# EAGLE design board_0.6v (EAGLE 7.7.0)
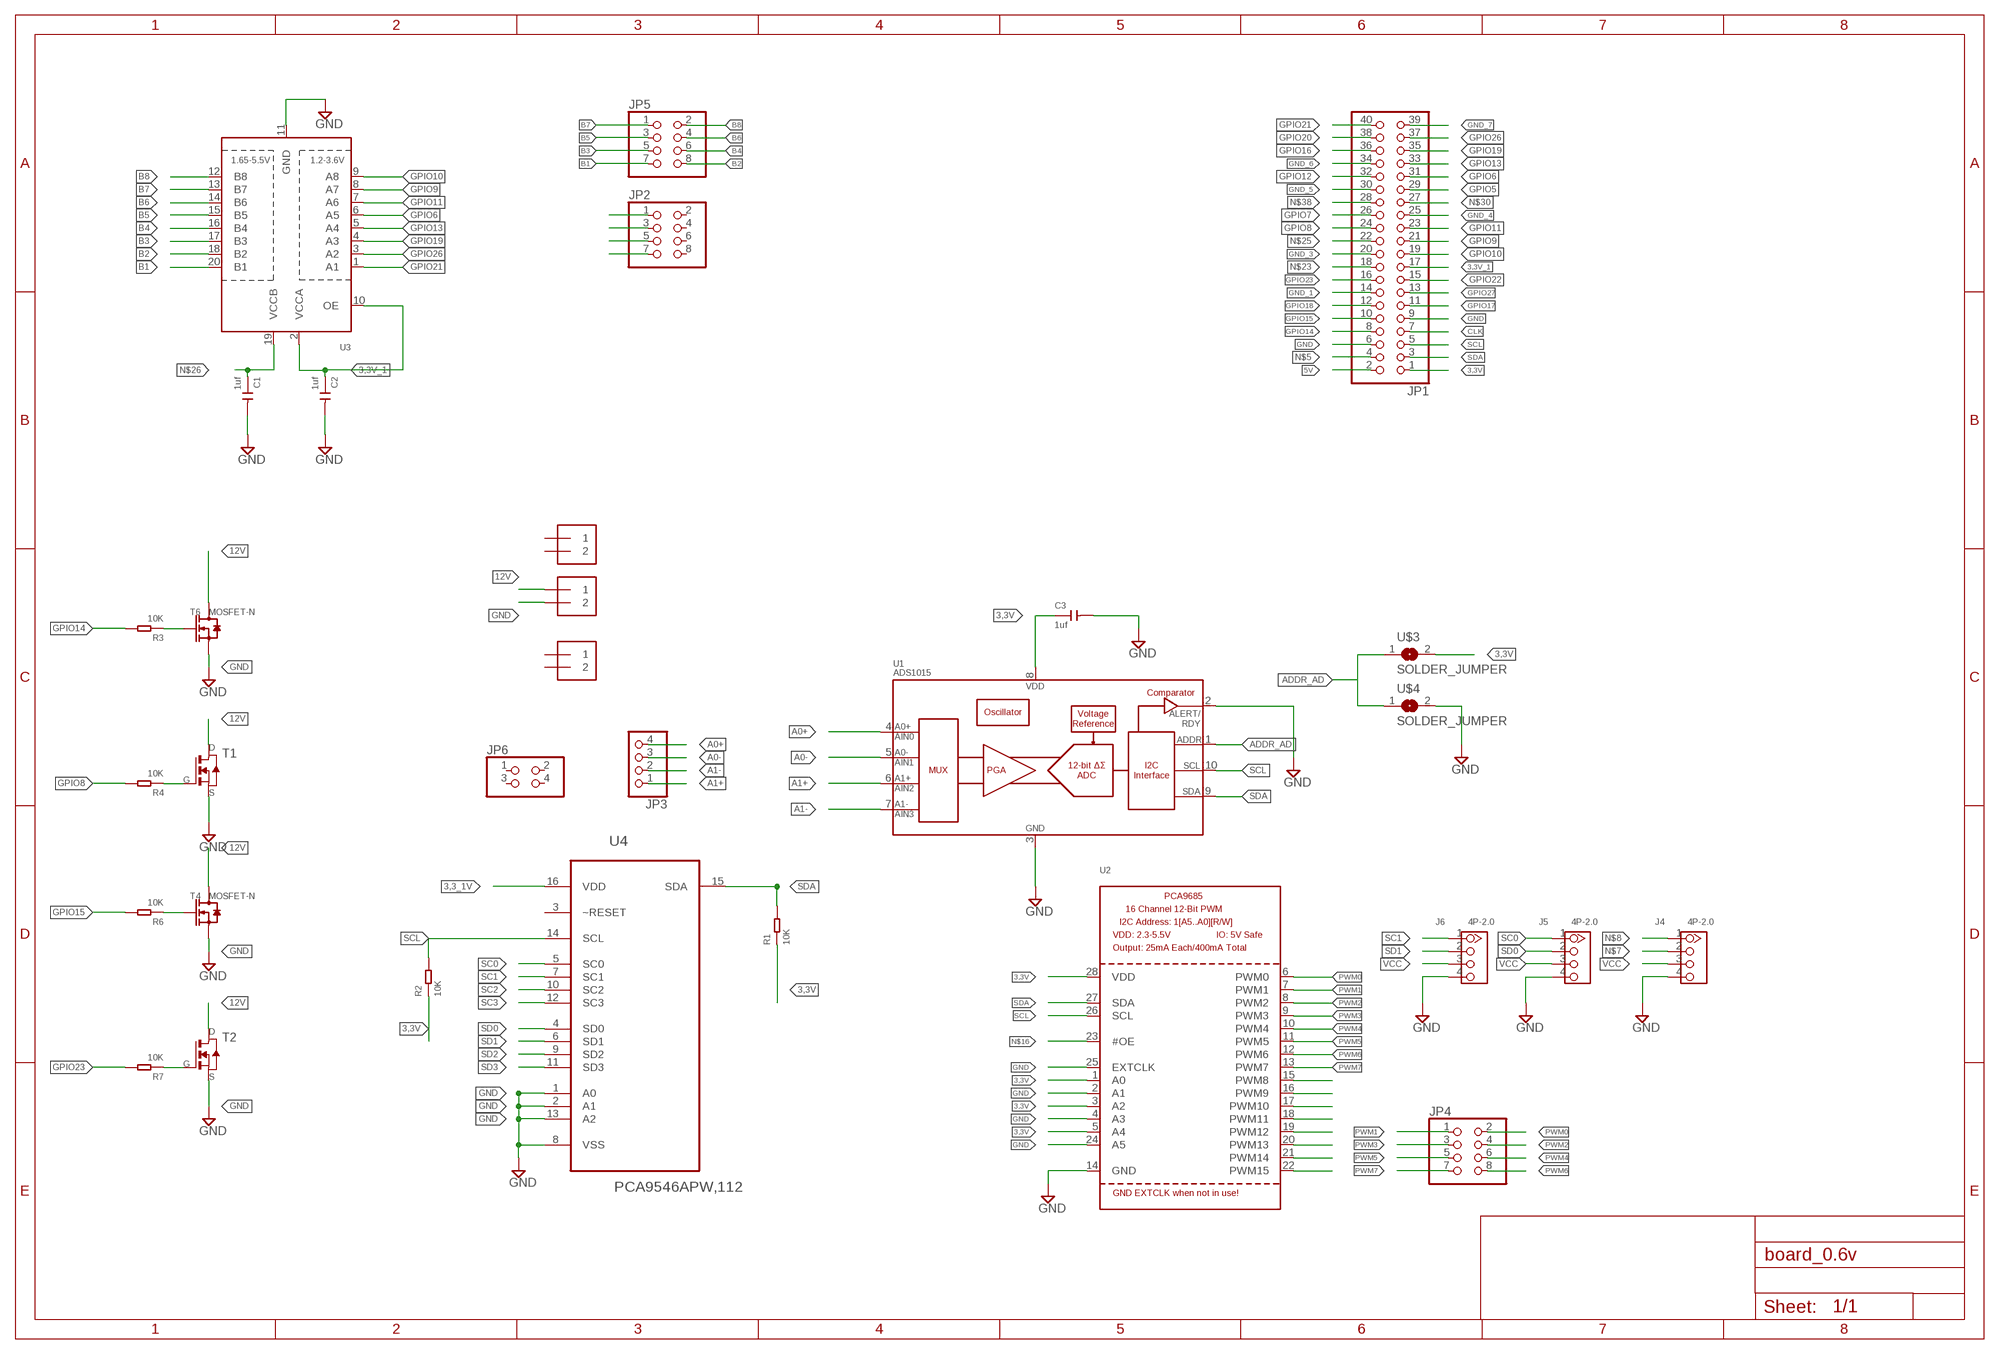
[diagram p0: schematic, sheet 1]

## Parts
C1  1uf  CERAMIC-1UF-25V-10%-X7R(0805)  [C0805]
C2  1uf  CERAMIC-1UF-25V-10%-X7R(0805)  [C0805]
C3  1uf  CERAMIC-1UF-25V-10%-X7R(0805)  [C0805]
J1  1X2-3.5MM  [1X2-3.5MM]
J2  1X2-3.5MM  [1X2-3.5MM]
J3  1X2-3.5MM  [1X2-3.5MM]
J4  4P-2.0  GROVE-CONNECTOR-DIP(4P-2.0)  [HW4-2.0]
J5  4P-2.0  GROVE-CONNECTOR-DIP(4P-2.0)  [HW4-2.0]
J6  4P-2.0  GROVE-CONNECTOR-DIP(4P-2.0)  [HW4-2.0]
JP1  PINHD-2X20  [2X20]
JP2  PINHD-2X4  [2X04]
JP3  PINHD-1X4  [1X04]
JP4  PINHD-2X4  [2X04]
JP5  PINHD-2X4  [2X04]
JP6  PINHD-2X2  [2X02]
R1  10K  SMD-RES-10K-1%-1/8W(0805)  [R0805]
R2  10K  SMD-RES-10K-1%-1/8W(0805)  [R0805]
R3  10K  SMD-RES-10K-1%-1/8W(0805)  [R0805]
R4  10K  SMD-RES-10K-1%-1/8W(0805)  [R0805]
R6  10K  SMD-RES-10K-1%-1/8W(0805)  [R0805]
R7  10K  SMD-RES-10K-1%-1/8W(0805)  [R0805]
T1  NMOSFETTO252  [TO252]
T2  NMOSFETTO252  [TO252]
T4  MOSFET-N  [SOT-23]
T6  MOSFET-N  [SOT-23]
U1  ADS1015  [MSOP10]
U2  PCA9685  [TSSOP28]
U3  TXB0108PWR  [TSSOP20]
U4  PCA9546APW,112  [SOP65P640X110-16N]
U$3  SOLDER_JUMPER  [SJFAB]
U$4  SOLDER_JUMPER  [SJFAB]

## Nets
3,3_1V: U4.16(VDD)
3,3V: C3.1 JP1.1 R1.1 R2.1 U1.8(VDD) U2.1(A0) U2.3(A2) U2.5(A4) U2.28(VDD) U$3.2
3,3V_1: C2.1 JP1.17 U3.2(VCCA) U3.10(OE)
5V: JP1.2
12V: J2.1 T1.3(D) T2.3(D) T4.3(D) T6.3(D)
A0+: JP3.4 U1.4(AIN0)
A0-: JP3.3 U1.5(AIN1)
A1+: JP3.1 U1.6(AIN2)
A1-: JP3.2 U1.7(AIN3)
ADDR_AD: U1.1(ADDR) U$3.1 U$4.1
B1: JP5.7 U3.20(B1)
B2: JP5.8 U3.18(B2)
B3: JP5.5 U3.17(B3)
B4: JP5.6 U3.16(B4)
B5: JP5.3 U3.15(B5)
B6: JP5.4 U3.14(B6)
B7: JP5.1 U3.13(B7)
B8: JP5.2 U3.12(B8)
CLK: JP1.7
GND: C1.2 C2.2 C3.2 J2.2 J4.4 J5.4 J6.4 JP1.6 JP1.9 T1.2(S) T2.2(S) T4.2(S) T6.2(S) U1.2(ALERT/RDY) U1.3(VSS) U2.2(A1) U2.4(A3) U2.14(GND) U2.24(A5) U2.25(EXTCLK) U3.11(GND) U4.1(A0) U4.2(A1) U4.8(VSS) U4.13(A2) U$4.2
GND_1: JP1.14
GND_3: JP1.20
GND_4: JP1.25
GND_5: JP1.30
GND_6: JP1.34
GND_7: JP1.39
GPIO5: JP1.29
GPIO6: JP1.31 U3.6(A5)
GPIO7: JP1.26
GPIO8: JP1.24 R4.2
GPIO9: JP1.21 U3.8(A7)
GPIO10: JP1.19 U3.9(A8)
GPIO11: JP1.23 U3.7(A6)
GPIO12: JP1.32
GPIO13: JP1.33 U3.5(A4)
GPIO14: JP1.8 R3.2
GPIO15: JP1.10 R6.2
GPIO16: JP1.36
GPIO17: JP1.11
GPIO18: JP1.12
GPIO19: JP1.35 U3.4(A3)
GPIO20: JP1.38
GPIO21: JP1.40 U3.1(A1)
GPIO22: JP1.15
GPIO23: JP1.16 R7.2
GPIO26: JP1.37 U3.3(A2)
GPIO27: JP1.13
N$5: JP1.4
N$6: R3.1 T6.1(G)
N$7: J4.2
N$8: J4.1
N$9: R4.1 T1.1(G)
N$10: R6.1 T4.1(G)
N$11: R7.1 T2.1(G)
N$13: JP2.1
N$14: JP2.3
N$15: JP2.5
N$16: U2.23(#OE)
N$17: JP2.7
N$22: U2.15(PWM8)
N$23: JP1.18
N$24: U2.16(PWM9)
N$25: JP1.22
N$26: C1.1 U3.19(VCCB)
N$27: U2.17(PWM10)
N$28: U2.18(PWM11)
N$29: U2.19(PWM12)
N$30: JP1.27
N$31: U2.20(PWM13)
N$32: U2.21(PWM14)
N$33: U2.22(PWM15)
N$38: JP1.28
PWM0: JP4.2 U2.6(PWM0)
PWM1: JP4.1 U2.7(PWM1)
PWM2: JP4.4 U2.8(PWM2)
PWM3: JP4.3 U2.9(PWM3)
PWM4: JP4.6 U2.10(PWM4)
PWM5: JP4.5 U2.11(PWM5)
PWM6: JP4.8 U2.12(PWM6)
PWM7: JP4.7 U2.13(PWM7)
SC0: J5.1 U4.5(SC0)
SC1: J6.1 U4.7(SC1)
SC2: U4.10(SC2)
SC3: U4.12(SC3)
SCL: JP1.5 R2.2 U1.10(SCL) U2.26(SCL) U4.14(SCL)
SD0: J5.2 U4.4(SD0)
SD1: J6.2 U4.6(SD1)
SD2: U4.9(SD2)
SD3: U4.11(SD3)
SDA: JP1.3 R1.2 U1.9(SDA) U2.27(SDA) U4.15(SDA)
VCC: J4.3 J5.3 J6.3
Unconnected: J1.1 J1.2 J3.1 J3.2 JP2.2 JP2.4 JP2.6 JP2.8 JP6.1 JP6.2 JP6.3 JP6.4 U4.3(~RESET)

## Library data of the parts
C1-C3 = Seeed-OPL-Capacitor:CERAMIC-1UF-25V-10%-X7R(0805): 302010179; MPN: CC0805KKX7R8BB105
J1-J3 = adafruit:1X2: 3.5mm Terminal block http://www.ladyada.net/library/pcb/eaglelibrary.html
J4-J6 = Seeed-OPL-Connector:GROVE-CONNECTOR-DIP(4P-2.0): 320110033
JP1 = adafruit:PINHD-2X20: PIN HEADER
JP2 JP4 JP5 = adafruit:PINHD-2X4: PIN HEADER
JP3 = pinhead:PINHD-1X4: PIN HEADER
JP6 = pinhead:PINHD-2X2: PIN HEADER
R1-R4 R6 R7 = Seeed-OPL-Resistor:SMD-RES-10K-1%-1/8W(0805): 301010361; MPN: RC0805FR-0710KL
T1 T2 = fab_2:NMOSFET: MOS FET
T4 T6 = Seeed-OPL-Transistor:MOSFET-N
U1 = SparkFun-IC-Conversion:ADS1015: ADS1015 12-BIT ADC 12-Bit Del-Sig ADC Four single-ended inputs or two differential inputs Internal PGA I2C interface 2.0-5.5V SparkFun Products SparkFun Block for Intel Edison - ADC <https://www.sparkfun.com/products/13770> (DEV-13770); PROD_ID: IC-12270
U2 = adafruit:PCA9685: PCA9685 - 16 Channel 12-Bit I2C PWM Controller 5.0V tolerant 16 channel, 12-bit I2C PWM controller with 25mA per output (max. 400mA total) Digikey: 568-5931-1-ND
U3 = adafruit:TXB0108PWR: 8-Bit Bi-Directional Level Shifter 1.2V-3.6V (VCCA) to 1.65V-5.5V (VCCB) bi-directional level shifter with auto direction sensing. Max data rate - VCCA 1.8V: 20Mbps (50ns), VCCA 3.3V: 100Mbps (10ns) Digikey: 296-21527-1-ND
U4 = NXP_By_element14_Batch_1:PCA9546APW,112: 4-channel I2C-bus switch with reset; MPN: PCA9546APW,112; OC_FARNELL: 1831208; OC_NEWARK: 70R6610; PACKAGE: TSSOP-16; SUPPLIER: NXP
U$3 U$4 = fab:SOLDER_JUMPER

## Board
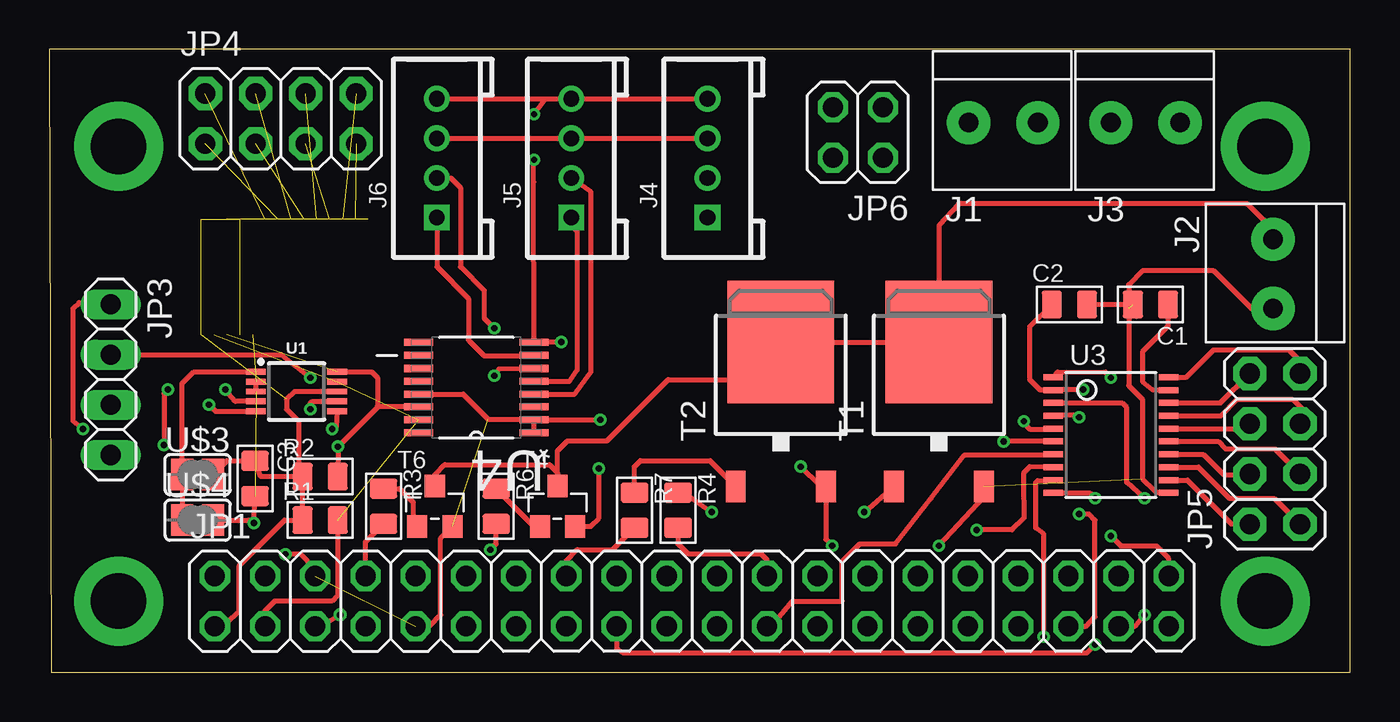
[diagram p1: board, top side]
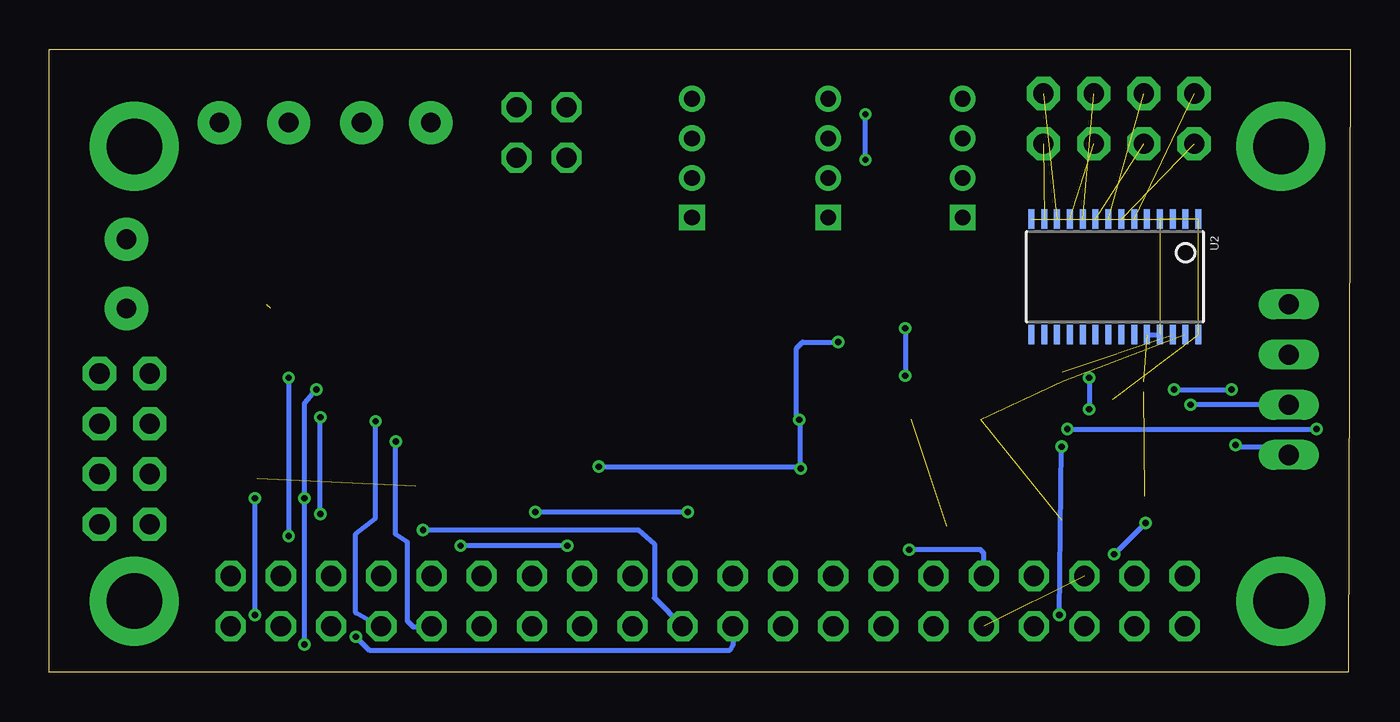
[diagram p2: board, bottom side, seen from below]

Size 65.8 x 31.5 mm. Coordinates in mm from the lower left corner, seen from the top.
Outline: 0.1,0 65.8,0 65.8,31.5 0,31.5 0.1,0
Copper layers (1*16): Top 0.035mm / dielectric 1.5mm / Bottom 0.035mm
Design rules "SeeedStudio_2layer_DRU_no_angle_20140221": minimum track width 6mil, minimum drill 12mil, track to track 6mil, track to pad 6mil, pad to pad 6mil, via to via 6mil, smd to smd 0mil, copper to edge 10mil, drill to drill 10mil, minimum pad ring 10mil, minimum via ring 6mil, stop-mask expansion 2mil, vias tented up to drill 100mil, thermal gap 10mil

### Footprints (pad centres in the part's own frame; a part is rotated, then mirrored left to right if it is on the bottom)
C0805 = smd 1.397 x 1.016: 1 0,0.889; 2 0,-0.889
1X2-3.5MM = drill 1 pad 2.184: 1 1.8,0; 2 -1.7,0
HW4-2.0 = drill 0.8 pad 1.27 square: 1 -3,0 | drill 0.8 pad 1.27: 2 -1,0; 3 1,0; 4 3,0
2X20 = drill 1.016 octagon: 1 -24.13,-1.27; 2 -24.13,1.27; 3 -21.59,-1.27; 4 -21.59,1.27; 5 -19.05,-1.27; 6 -19.05,1.27; 7 -16.51,-1.27; 8 -16.51,1.27; 9 -13.97,-1.27; 10 -13.97,1.27; 11 -11.43,-1.27; 12 -11.43,1.27; 13 -8.89,-1.27; 14 -8.89,1.27; 15 -6.35,-1.27; 16 -6.35,1.27; 17 -3.81,-1.27; 18 -3.81,1.27; 19 -1.27,-1.27; 20 -1.27,1.27; 21 1.27,-1.27; 22 1.27,1.27; 23 3.81,-1.27; 24 3.81,1.27; 25 6.35,-1.27; 26 6.35,1.27; 27 8.89,-1.27; 28 8.89,1.27; 29 11.43,-1.27; 30 11.43,1.27; 31 13.97,-1.27; 32 13.97,1.27; 33 16.51,-1.27; 34 16.51,1.27; 35 19.05,-1.27; 36 19.05,1.27; 37 21.59,-1.27; 38 21.59,1.27; 39 24.13,-1.27; 40 24.13,1.27
2X04 = drill 1.016 pad 1.676 octagon: 1 -3.81,-1.27; 2 -3.81,1.27; 3 -1.27,-1.27; 4 -1.27,1.27; 5 1.27,-1.27; 6 1.27,1.27; 7 3.81,-1.27; 8 3.81,1.27
1X04 = drill 1.016 long: 1 -3.81,0; 2 -1.27,0; 3 1.27,0; 4 3.81,0
2X02 = drill 1.016 octagon: 1 -1.27,-1.27; 2 -1.27,1.27; 3 1.27,-1.27; 4 1.27,1.27
R0805 = smd 1.397 x 1.016: 1 0,0.889; 2 0,-0.889
TO252 = smd 1 x 1.6: 1 -2.28,-4.8; 2 2.28,-4.8 | smd 5.4 x 6.2: 3 0,2.5
SOT-23 = smd 1.016 x 1.143: 1 -0.889,-1.016; 2 0.889,-1.016; 3 0,1.016
MSOP10 = smd 0.3 x 1: 1 -1,-2.05; 2 -0.5,-2.05; 3 0,-2.05; 4 0.5,-2.05; 5 1,-2.05; 6 1,2.05; 7 0.5,2.05; 8 0,2.05; 9 -0.5,2.05; 10 -1,2.05
TSSOP28 = smd 0.305 x 0.991: 1 -4.225,-2.918; 2 -3.575,-2.918; 3 -2.925,-2.918; 4 -2.275,-2.918; 5 -1.625,-2.918; 6 -0.975,-2.918; 7 -0.325,-2.918; 8 0.325,-2.918; 9 0.975,-2.918; 10 1.625,-2.918; 11 2.275,-2.918; 12 2.925,-2.918; 13 3.575,-2.918; 14 4.225,-2.918; 15 4.225,2.918; 16 3.575,2.918; 17 2.925,2.918; 18 2.275,2.918; 19 1.625,2.918; 20 0.975,2.918; 21 0.325,2.918; 22 -0.325,2.918; 23 -0.975,2.918; 24 -1.625,2.918; 25 -2.275,2.918; 26 -2.925,2.918; 27 -3.575,2.918; 28 -4.225,2.918
TSSOP20 = smd 0.305 x 0.991: 1 -2.925,-2.918; 2 -2.275,-2.918; 3 -1.625,-2.918; 4 -0.975,-2.918; 5 -0.325,-2.918; 6 0.325,-2.918; 7 0.975,-2.918; 8 1.625,-2.918; 9 2.275,-2.918; 10 2.925,-2.918; 11 2.925,2.918; 12 2.275,2.918; 13 1.625,2.918; 14 0.975,2.918; 15 0.325,2.918; 16 -0.325,2.918; 17 -0.975,2.918; 18 -1.625,2.918; 19 -2.275,2.918; 20 -2.925,2.918
SOP65P640X110-16N = smd 1.473 x 0.356: 1 -2.921,2.286; 2 -2.921,1.626; 3 -2.921,0.965; 4 -2.921,0.33; 5 -2.921,-0.33; 6 -2.921,-0.965; 7 -2.921,-1.626; 8 -2.921,-2.286; 9 2.921,-2.286; 10 2.921,-1.626; 11 2.921,-0.965; 12 2.921,-0.33; 13 2.921,0.33; 14 2.921,0.965; 15 2.921,1.626; 16 2.921,2.286
SJFAB = smd 1.118 x 1.6: 1 -0.787,0; 2 0.787,0

### Placement (x,y rotation side)
C1  55.7,18.6 270 top
C2  51.6,18.6 90 top
C3  10.4,9.8 0 top
J1  48.3,27.8 180 top
J2  61.9,20.1 90 top
J3  55.5,27.8 180 top
J4  33.3,26 90 top
J5  26.4,26 90 top
J6  19.6,26 90 top
JP1  32.5,3.6 0 top
JP2  7.7,-15 0 top  (outside the outline)
JP3  3.1,14.8 270 top
JP4  11.7,28 0 top
JP5  62,11.3 90 top
JP6  40.9,27.3 180 top
R1  13.7,7.7 90 top
R2  13.7,9.9 90 top
R3  16.9,8.4 0 top
R4  31.8,8.2 0 top
R6  22.6,8.4 0 top
R7  29.6,8.2 0 top
T1  45,14.2 0 top
T2  37,14.2 0 top
T4  25.7,8.4 0 top
T6  19.5,8.4 0 top
U1  12.5,14.2 270 top
U2  11.9,20 180 bottom
U3  53.7,12 270 top
U4  21.6,14.4 180 top
U$3  7.5,10 0 top
U$4  7.5,7.7 0 top

### Tracks (layer width: path | path; a pad name or v marks a point on that pad's centre or on a via)
3,3V  (4 unrouted)
  Top 0.254: U$3.2 8.99,10.7 C3.1 10.69,9.9 R2.1 | R2.1 R1.1 11.9,7.7 10.6,6.4 9.81,5.6 9.6,5.4 9.6,3.1 8.73,2.33 JP1.1 | U1.8 12.4,14.2 12,13.8 12,13.3 12.6,12.7 12.6,9.91 R2.1
3,3V_1  (via drill 0.32)
  Top 0.254: JP1.17 28.69,1.21 29,1 52.5,1 v52.9,1.4 | v52.3,14.3 50.86,14.3 U3.2 50.12,14.27 49.6,14.8 49.6,17.49 C2.1 50.61,18.7 | U3.10 52.62,9.07 v52.9,8.8
  Bottom 0.254: v52.9,1.4 v52.9,8.8 52.9,13.6 v52.3,14.3
12V
  Top 0.254: J2.1 61.9,22.4 60.6,23.7 46,23.7 45,22.6 T1.3 T2.3 36.7,15.3 36.4,15.3 35.9,14.8 31.3,14.8 28.2,11.7 26.2,11.7 25.7,11.2 T4.3 25.7,10.1 25.3,10.5 20,10.5 19.5,10 T6.3
A0+  (via drill 0.32, 0.32 pad 0.25)
  Top 0.254: U1.4 9.4,13.7 v8.9,14.3 | v6,14.3 5.8,14.1 v5.8,11.5
  Bottom 0.254: v8.9,14.3 v6,14.3 | v5.8,11.5 5.6,11.4 3.51,11.4 JP3.4
A0-  (via drill 0.32)
  Top 0.254: v8.07,13.53 8.4,13.2 U1.5
  Bottom 0.254: JP3.3 v8.07,13.53
A1+  (via drill 0.32)
  Top 0.254: U1.6 14.5,12.4 14.4,12.3 v14.3,12.3 | v1.7,12.3 1.2,12.7 1.2,18.4 1.5,18.7 3.01,18.7 JP3.1
  Bottom 0.254: v14.3,12.3 v1.7,12.3
A1-  (via drill 0.32)
  Top 0.254: JP3.2 11.73,16.07 v13.2,14.9 | v13.2,13.3 13.2,13.6 13.3,13.7 U1.7
  Bottom 0.254: v13.2,14.9 v13.2,13.3
ADDR_AD
  Top 0.254: U1.1 7.3,15.2 6.71,14.61 U$3.1 U$4.1
B1
  Top 0.254: U3.20 57.52,14.93 58.9,16.3 62.7,16.3 63.3,15.7 63.3,15.14 JP5.7
B2
  Top 0.254: U3.18 59.24,13.62 JP5.8
B3
  Top 0.254: U3.17 59.27,12.97 60.1,13.8 62.9,13.8 63.4,13.3 63.4,12.7 JP5.5
B4
  Top 0.254: U3.16 60.48,12.32 JP5.6
B5
  Top 0.254: U3.15 59.12,11.67 59.5,11.3 62,11.3 JP5.3
B6
  Top 0.254: U3.14 58.38,11.02 59.4,10 60.7,10 JP5.4
B7
  Top 0.254: U3.13 58.12,10.38 59.7,8.8 61.96,8.8 JP5.1
B8
  Top 0.254: U3.12 57.58,9.72 59.81,7.49 JP5.2
GND  (via drill 0.32)  (9 unrouted)
  Top 0.254: U1.3 U1.2 | U4.1 U4.2 | J4.4 J5.4 25.1,29 | J6.4 25.1,29 | C1.2 C2.2 | J2.2 60.8,18.4 58.9,20.3 55.3,20.3 54.6,19.6 54.6,18.4 | 54.6,18.4 55,18 | U$4.2 10.09,7.7 v10.35,7.56 C3.2 | JP1.6 13.4,5.3 12.73,5.97 v11.93,5.97 | v24.52,28.22 25.1,29 | v24.52,25.92 24.5,25.9 24.5,24.8 U4.8 24.54,16.7 v25.9,16.7 | U4.2 v27.87,12.77 | v39.6,6.4 39.28,6.72 T2.2 39,9.4 v38,10.4 | v45,6.4 47.3,8.88 T1.2 | JP1.9 19.23,2.33 19.8,2.9 19.8,6.8 T6.2 | T4.2 27.38,7.38 27.8,7.8 v27.8,10.3 | U4.13 20.93,14.07 22.2,12.8 24.5,12.8 U4.2 | 54.6,18.4 54.6,14.5 55.3,13.8 55.3,9.8 55.9,9.2 55.99,9.1 U3.11
  Bottom 0.254: v11.93,5.97 v10.35,7.56 | v24.52,25.92 v24.52,28.22 | v25.9,16.7 27.7,16.7 28,16.4 28,12.9 v27.87,12.77 27.8,12.65 v27.8,10.3 27.9,10.4 v38,10.4 | v39.6,6.4 v45,6.4 | U2.24 U2.25
GPIO6  (via drill 0.32)
  Top 0.254: U3.6 v48.27,11.67
  Bottom 0.254: v48.27,11.67 48.3,11.6 48.3,7 47.7,6.6 47.7,2.6 47.4,2.3 46.5,2.3 JP1.31
GPIO8
  Top 0.254: R4.2 31.8,6.5 32.3,6 36,6 36.3,5.7 JP1.24
GPIO9  (via drill 0.32)
  Top 0.254: U3.8 49.6,10.4 49.27,10.07 49.27,9.67 49.3,7.8 48.7,7.2 v46.9,7.2
  Bottom 0.254: v46.9,7.2 36,7.2 35.2,6.5 35.2,3.76 JP1.21
GPIO10  (via drill 0.32)
  Top 0.254: v50.3,1.8 50.3,7 49.9,7.3 49.9,9.6 50,9.7 U3.9
  Bottom 0.254: JP1.19 31.23,1.37 31.4,1.1 49.6,1.1 v50.3,1.8
GPIO11
  Top 0.254: JP1.23 36.53,2.33 37.6,3.6 40.1,3.6 40.1,5.6 41,6.5 42.8,6.5 44.6,8.8 46.3,11 50.76,11 U3.7
GPIO13  (via drill 0.32)
  Top 0.254: v49.3,12.7 49.3,12.6 49.6,12.3 50.76,12.3 U3.5
  Bottom 0.254: JP1.33 49.13,2.33 50.3,3 50.3,7 49.3,7.8 v49.3,12.7
GPIO14
  Top 0.254: JP1.8 15.99,6.6 R3.2
GPIO15  (via drill 0.32)
  Top 0.254: v22.3,6.2 22.6,6.5 R6.2
  Bottom 0.254: JP1.10 18.53,6.03 18.7,6.2 v22.3,6.2
GPIO19  (via drill 0.32)
  Top 0.254: JP1.35 52.47,2.33 52.9,2.8 52.9,7.7 52.6,8 v52.1,8 | v52.1,12.9 52,13 50.81,13 U3.4
  Bottom 0.254: v52.1,8 v52.1,12.9
GPIO21  (via drill 0.32)
  Top 0.254: U3.1 50.83,14.93 51,15.2 53.42,15.18 v53.7,14.9 | v53.7,6.9 54.2,6.4 56,6.4 56.6,5.8 56.6,4.9 JP1.40
  Bottom 0.254: v53.7,14.9 v53.7,6.9
GPIO23
  Top 0.254: JP1.16 26.15,5.65 26.7,6.2 28.49,6.2 R7.2
GPIO26  (via drill 0.32)
  Top 0.254: JP1.37 54.93,2.33 v55.4,2.9 | v55.4,8.8 54.5,9.6 54.5,13.4 54.3,13.6 50.81,13.6 U3.3
  Bottom 0.254: v55.4,2.9 v55.4,8.8
N$1  (via drill 2.8 pad 4.5)
  other vias: 61.5,26.6
N$2  (via drill 2.8 pad 4.5)
  other vias: 3.5,26.6
N$3  (via drill 2.8 pad 4.5)
  other vias: 3.5,3.6
N$4  (via drill 2.8 pad 4.5)
  other vias: 61.5,3.6
N$6
  Top 0.254: R3.1 17.71,9.29 18.4,8.6 18.4,7.59 T6.1
N$9  (via drill 0.32)
  Top 0.254: R4.1 32.11,9.09 v33.5,8.1 | v41.22,8.1 T1.1
  Bottom 0.254: v33.5,8.1 v41.22,8.1
N$10
  Top 0.254: T4.1 24.5,7.38 R6.1
N$11
  Top 0.254: R7.1 29.6,10.4 29.9,10.7 33.42,10.7 T2.1
N$26
  Top 0.254: C1.1 56.59,17.49 55.3,16.2 55.3,14.7 55.8,14.3 56.54,14.3 U3.19
PWM0  (1 unrouted)
PWM1  (1 unrouted)
PWM2  (1 unrouted)
PWM3  (1 unrouted)
PWM4  (1 unrouted)
PWM5  (1 unrouted)
PWM6  (1 unrouted)
PWM7  (1 unrouted)
SC0
  Top 0.254: J5.1 26.4,22.6 26.7,22.3 26.7,15.3 26.3,14.7 24.55,14.7 U4.5
SC1
  Top 0.254: J6.1 19.6,20.5 21.2,18.9 21.2,16.8 22,16 24.5,16 U4.7
SCL  (via drill 0.32 pad 0.26, 0.35 pad 0.25)  (1 unrouted)
  Top 0.254: JP1.5 13.73,2.33 v14.7,2.9 | v14.6,11.4 v14.6,11.41 | v14.6,11.41 R2.2 | U4.14 16.62,13.43 | 16.62,13.43 v14.6,11.41 | U1.10 16.3,15.2 16.6,14.9 16.6,13.46 16.62,13.43
  Bottom 0.254: v14.7,2.9 v14.6,11.41
SD0
  Top 0.254: U4.4 26.57,14.07 27.4,15.2 27.4,24.3 J5.2
SD1  (via drill 0.32 pad 0.25)
  Top 0.254: J6.2 20.3,25 20.8,24.5 20.8,20.5 22,19.3 22,17.9 v22.5,17.4 | v22.5,15 22.74,15.35 U4.6
  Bottom 0.254: v22.5,17.4 v22.5,15
SDA  (3 unrouted)
  Top 0.254: R1.2 14.59,3.89 14.3,3.6 11.4,3.6 10.9,3.1 JP1.3
VCC
  Top 0.254: J6.3 J5.3 J4.3

### Text on the board
Top: + Puertos | Conecto 12v / + pquenio | Reloj ? | Bridget | Regulador de 12 volts | Regulador de 6 volts